# EAGLE schematic basePCB (EAGLE 7.3.0)
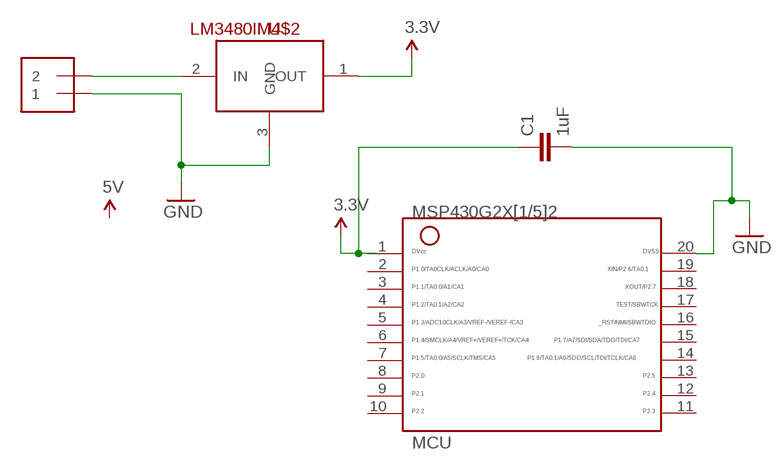
[diagram p0: schematic, sheet 1]

## Parts
C1  1uF  CAPPTH  [CAP-PTH-SMALL]
J1  1X2-3.5MM  [1X2-3.5MM]
MCU  G2X[1/5]2---N20  [N20]
U$2  LM3480IM4  [SOT23-3]

## Nets
3.3V [supply]: C1.1 U$2.1(OUT)
GND [supply]: C1.2 J1.1 MCU.20 U$2.3(GND)
N$1 [supply]: J1.2 U$2.2(IN)
Unconnected: MCU.1 MCU.2 MCU.3 MCU.4 MCU.5 MCU.6 MCU.7 MCU.8 MCU.9 MCU.10 MCU.11 MCU.12 MCU.13 MCU.14 MCU.15 MCU.16 MCU.17 MCU.18 MCU.19

## Library data of the parts
C1 = SparkFun-Capacitors:CAP: Capacitor Standard 0603 ceramic capacitor, and 0.1" leaded capacitor.
J1 = adafruit:1X2: 3.5mm Terminal block http://www.ladyada.net/library/pcb/eaglelibrary.html
MCU = TI_MSP430_v16:G2X[1/5]2---N20: MSP430G2X[1/5]2 MSP430G2x52, MSP430G2x12 PDIP (N) 20 Pin Package http://focus.ti.com/docs/prod/folders/print/msp430g2452.html
U$2 = SparkFun-PowerIC:LM3480IM4: Small package linear regulator

## Net classes
0 default: width 0.254 mm, clearance 0.254 mm
1 supply: width 0.508 mm, clearance 0.508 mm